# EAGLE design StepperBreakout (EAGLE 6.5.0)
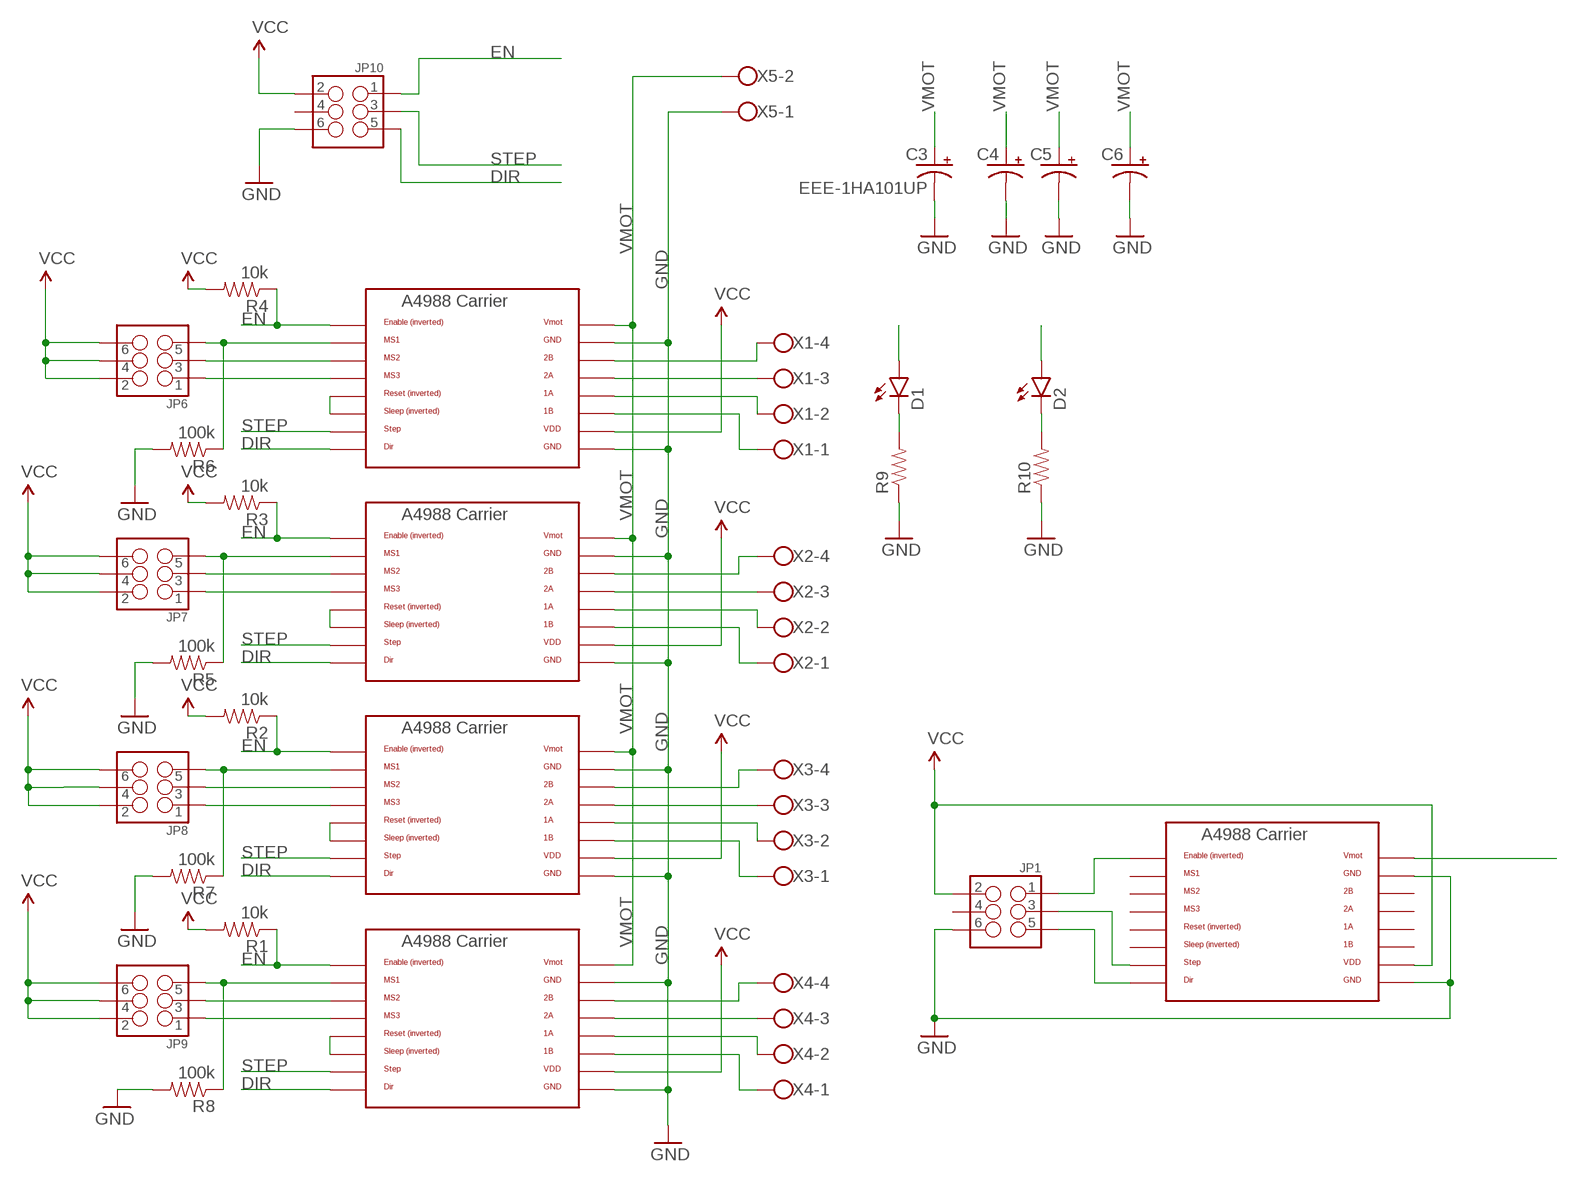
[diagram p0: schematic, sheet 1]

## Parts
C3  EEE-1HA101UP  CAP_POLE  [PANASONIC_E]
C4  CAP_POLE  [PANASONIC_E]
C5  CAP_POLE  [PANASONIC_E]
C6  CAP_POLE  [PANASONIC_E]
D1  LED0603  [LED-0603]
D2  LED0603  [LED-0603]
JP1  M03X2SHROUD  [2X3-SHROUDED]
JP6  M03X2NO_SILK  [2X3-NS]
JP7  M03X2NO_SILK  [2X3-NS]
JP8  M03X2NO_SILK  [2X3-NS]
JP9  M03X2NO_SILK  [2X3-NS]
JP10  M03X2SHROUD  [2X3-SHROUDED]
R1  10k  RESISTOR0805-RES  [0805]
R2  10k  RESISTOR0805-RES  [0805]
R3  10k  RESISTOR0805-RES  [0805]
R4  10k  RESISTOR0805-RES  [0805]
R5  100k  RESISTOR0805-RES  [0805]
R6  100k  RESISTOR0805-RES  [0805]
R7  100k  RESISTOR0805-RES  [0805]
R8  100k  RESISTOR0805-RES  [0805]
R9  RESISTOR0805-RES  [0805]
R10  RESISTOR0805-RES  [0805]
U$1  POLOLU_A4983CARRIER  [A4988BREAKOUT]
U$2  POLOLU_A4983CARRIER  [A4988BREAKOUT]
U$3  POLOLU_A4983CARRIER  [A4988BREAKOUT]
U$4  POLOLU_A4983CARRIER  [A4988BREAKOUT]
U$7  A4988BREAKOUT  [A4988BREAKOUT]
X1  W237-4  [W237-4]
X2  W237-4  [W237-4]
X3  W237-4  [W237-4]
X4  W237-4  [W237-4]
X5  W237-102  [W237-102]

## Nets
DIR: JP10.5 U$1.DIR U$2.DIR U$3.DIR U$4.DIR
EN: JP10.1 R1.1 R2.1 R3.1 R4.1 U$1.EN U$2.EN U$3.EN U$4.EN
GND: C3.- C4.- C5.- C6.- JP1.6 JP10.6 R5.2 R6.2 R7.2 R8.2 R9.1 R10.1 U$1.GND U$1.GND@0(GND) U$2.GND U$2.GND@0(GND) U$3.GND U$3.GND@0(GND) U$4.GND U$4.GND@0(GND) U$7.GND U$7.GND@0(GND) X5.1
LOPOWER: JP1.2 U$7.VDD ; supply symbol labelled VCC
N$1: U$3.1B X2.1
N$2: U$3.1A X2.2
N$3: U$3.2A X2.3
N$4: U$3.2B X2.4
N$5: U$1.2B X3.4
N$6: U$1.2A X3.3
N$7: U$1.1A X3.2
N$8: U$1.1B X3.1
N$9: U$2.2B X4.4
N$10: U$2.2A X4.3
N$11: U$2.1A X4.2
N$12: U$2.1B X4.1
N$13: U$4.2B X1.4
N$14: U$4.2A X1.3
N$15: U$4.1A X1.2
N$16: U$4.1B X1.1
N$17: JP6.5 R6.1 U$4.MS1
N$18: JP6.3 U$4.MS2
N$19: JP6.1 U$4.MS3
N$20: JP7.5 R5.1 U$3.MS1
N$21: JP7.3 U$3.MS2
N$22: JP7.1 U$3.MS3
N$23: JP8.5 R7.1 U$1.MS1
N$24: JP8.3 U$1.MS2
N$25: JP8.1 U$1.MS3
N$26: JP9.5 R8.1 U$2.MS1
N$27: JP9.3 U$2.MS2
N$28: JP9.1 U$2.MS3
N$29: JP1.1 U$7.EN
N$30: D1.C R9.2
N$31: D2.C R10.2
N$32: JP1.5 U$7.DIR
N$33: U$2.RST U$2.SLP(SLEEP)
N$34: U$1.RST U$1.SLP(SLEEP)
N$35: U$3.RST U$3.SLP(SLEEP)
N$36: U$4.RST U$4.SLP(SLEEP)
N$37: JP1.3 U$7.STEP
N$38: U$7.VMOT
STEP: JP10.3 U$1.STEP U$2.STEP U$3.STEP U$4.STEP
VCC: D2.A JP6.2 JP6.4 JP6.6 JP7.2 JP7.4 JP7.6 JP8.2 JP8.4 JP8.6 JP9.2 JP9.4 JP9.6 JP10.2 R1.2 R2.2 R3.2 R4.2 U$1.VDD U$2.VDD U$3.VDD U$4.VDD
VMOT: C3.+ C4.+ C5.+ C6.+ D1.A U$1.VMOT U$2.VMOT U$3.VMOT U$4.VMOT X5.2
Unconnected: JP1.4 JP10.4 U$7.1A U$7.1B U$7.2A U$7.2B U$7.MS1 U$7.MS2 U$7.MS3 U$7.RST U$7.SLP(SLEEP)

## Library data of the parts
C3-C6 = SparkFun-Capacitors:CAP_POL: Capacitor Polarized These are standard SMD and PTH capacitors. Normally 10uF, 47uF, and 100uF in electrolytic and tantalum varieties. Always verify the external diameter of the through hole cap, it varies with capacity, voltage, and manufacturer. The EIA devices should be standard.
D1 D2 = SparkFun-LED:LED: LEDs Standard schematic elements and footprints for 5mm, 3mm, 1206, and 0603 sized LEDs. 5mm - Spark Fun Electronics SKU : COM-00529 (and others)
JP1 JP10 = SparkFun-Connectors:M03X2: 2x3 .1" header. Shrouded, with keying- CONN-10681 SMT- CONN-11415 Pogo pins- HW-11044; PROD_ID: CONN-10681
JP6-JP9 = SparkFun-Connectors:M03X2: 2x3 .1" header. Shrouded, with keying- CONN-10681 SMT- CONN-11415 Pogo pins- HW-11044
R1-R8 = SparkFun-Passives:RESISTOR: Resistor Basic schematic elements and footprints for 0603, 1206, and PTH resistors.
R9 R10 = SparkFun-Resistors:RESISTOR: Resistor Basic schematic elements and footprints for 0603, 1206, and PTH resistors.
U$1-U$4 = RepRapjr:POLOLU_A4983CARRIER
U$7 = RepRapjr:A4988BREAKOUT
X1-X4 = con-wago-500:W237-4: WAGO SCREW CLAMP; OC_FARNELL: unknown; OC_NEWARK: unknown
X5 = con-wago-500:W237-102: WAGO SCREW CLAMP; MPN: 237-102; OC_FARNELL: unknown; OC_NEWARK: 70K9898

## Board
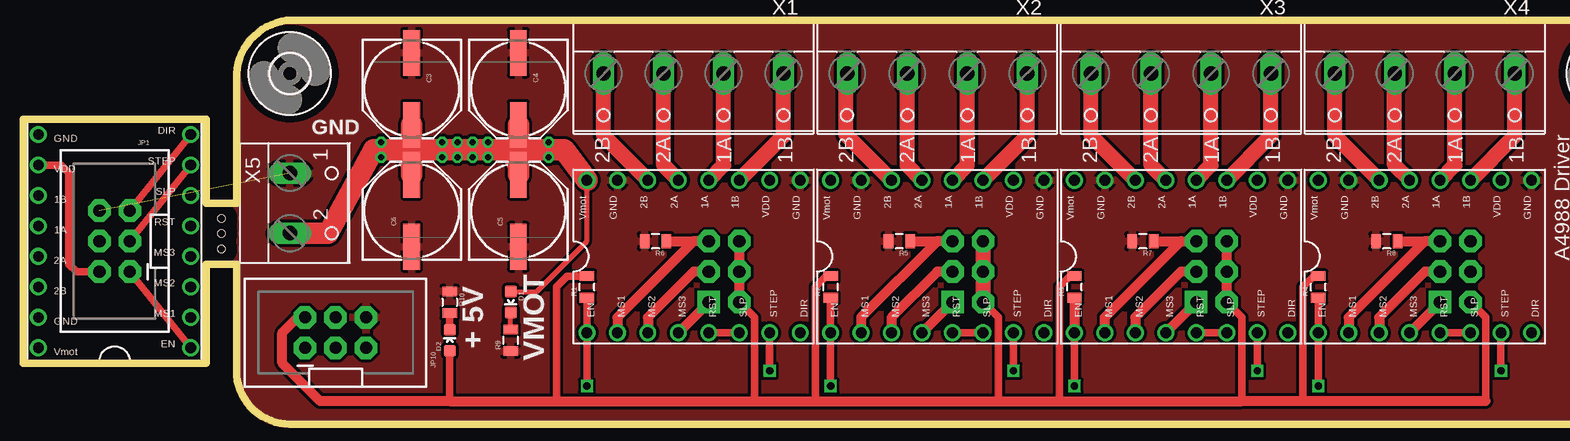
[diagram p1: board, top side]
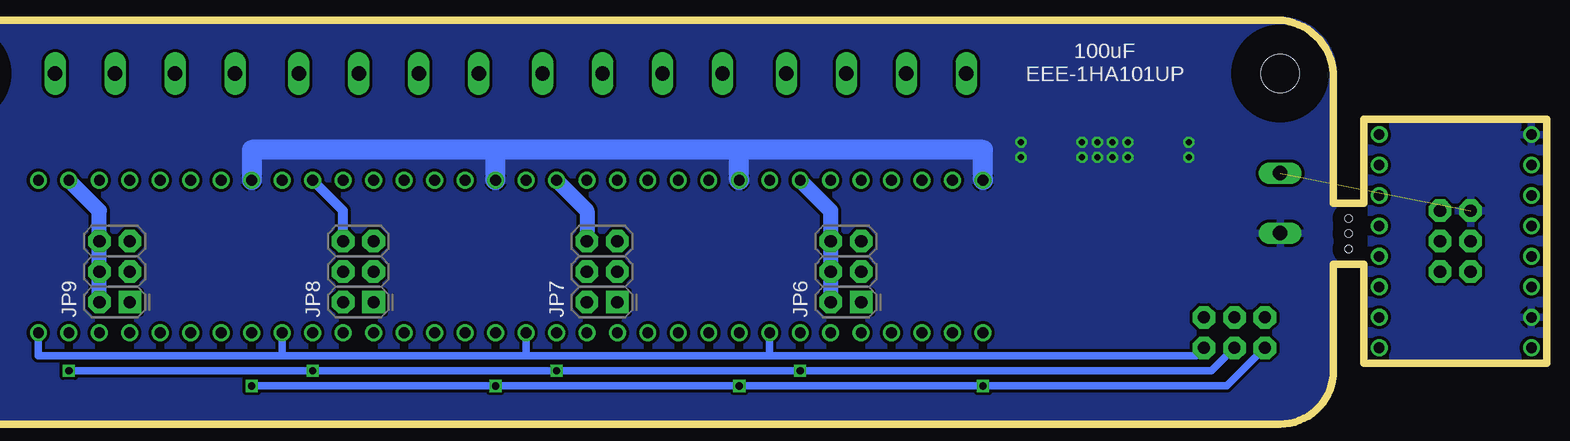
[diagram p2: board, bottom side, seen from below]

No outline drawn. Coordinates in mm, seen from the top.
Copper layers (1*16): Top 0.035mm / dielectric 1.5mm / Bottom 0.035mm
Design rules "default *": minimum track width 10mil, minimum drill 24mil, track to track 10mil, track to pad 10mil, pad to pad 10mil, via to via 10mil, smd to smd 10mil, copper to edge 40mil, drill to drill 8mil, minimum pad ring 10mil, minimum via ring 8mil, stop-mask expansion 4mil, vias tented up to drill 0mil, thermal gap 10mil
Holes 0.6 mm at 17.78,15.88 17.78,17.14 17.78,14.61
Milling: 16 lines

### Footprints (pad centres in the part's own frame; a part is rotated, then mirrored left to right if it is on the bottom)
PANASONIC_E = smd 3.8 x 1.4: + 3,0; - -3,0
LED-0603 = smd 1 x 1: A 0,-0.877; C 0,0.877
2X3-SHROUDED = drill 1.016 pad 1.88 octagon: 1 -1.27,2.54; 2 1.27,2.54; 3 -1.27,0; 4 1.27,0; 5 -1.27,-2.54; 6 1.27,-2.54
2X3-NS = drill 1.016 pad 1.88 square: 1 -2.54,-1.27 | drill 1.016 pad 1.88 octagon: 2 -2.54,1.27; 3 0,-1.27; 4 0,1.27; 5 2.54,-1.27; 6 2.54,1.27
0805 = smd 0.8 x 1.2: 1 -0.9,0; 2 0.9,0
A4988BREAKOUT = drill 0.9: 1A 8.89,1.27; 1B 11.43,1.27; 2A 6.35,1.27; 2B 3.81,1.27; DIR 16.51,-11.43; EN -1.27,-11.43; GND 16.51,1.27; GND@0 1.27,1.27; MS1 1.27,-11.43; MS2 3.81,-11.43; MS3 6.35,-11.43; RST 8.89,-11.43; SLP 11.43,-11.43; STEP 13.97,-11.43; VDD 13.97,1.27; VMOT -1.27,1.27
3,2 = hole 3.2: 0,0
W237-4 = drill 1.194 long: 1 -7.5,-1.27; 2 -2.5,-1.27; 3 2.5,-1.27; 4 7.5,-1.27
W237-102 = drill 1.194 long: 1 -2.5,-1.27; 2 2.5,-1.27

### Placement (x,y rotation side)
C3  33.66,27.94 270 top
C4  42.55,27.94 270 top
C5  42.55,17.78 90 top
C6  33.66,17.78 90 top
D1  41.91,10.16 180 top
D2  36.83,6.99 0 top
JP1  8.89,15.24 180 top
JP6  59.69,12.7 90 bottom
JP7  80.01,12.7 90 bottom
JP8  100.33,12.7 90 bottom
JP9  120.65,12.7 90 bottom
JP10  27.3,7.62 90 top
R1  48.26,11.43 90 top
R2  68.58,11.43 90 top
R3  88.9,11.43 90 top
R4  109.22,11.43 90 top
R5  74.3,15.24 180 top
R6  53.98,15.24 180 top
R7  94.61,15.24 180 top
R8  114.94,15.24 180 top
R9  41.91,6.99 90 top
R10  36.83,10.16 270 top
U$1  90.17,19.05 0 top
U$2  110.49,19.05 0 top
U$3  69.85,19.05 0 top
U$4  49.53,19.05 0 top
U$5  [3,2]  23.5,29.21 0 top
U$6  [OSHW-LOGO-M]  133.35,5.08 90 top
U$7  3.81,7.62 90 top
U$9  [3,2]  133.35,29.21 0 top
X1  57.15,27.94 180 top
X2  77.47,27.94 180 top
X3  97.79,27.94 180 top
X4  118.11,27.94 180 top
X5  24.77,18.41 270 top

### Tracks (layer width: path | path; a pad name or v marks a point on that pad's centre or on a via)
DIR
  Bottom 0.61: U$4.DIR 66.04,5.71 | 86.36,5.71 66.04,5.71 | U$3.DIR 86.36,5.71 | 86.36,5.71 106.68,5.71 | 106.68,5.71 U$1.DIR | U$2.DIR 127,5.71 106.68,5.71 | 66.04,5.71 30.48,5.71 JP10.5
EN  (via drill 0.6)
  Top 0.61: R1.1 U$4.EN v48.26,3.17 | R2.1 U$3.EN v68.58,3.17 | R4.1 U$2.EN v109.22,3.17 | U$1.EN v88.9,3.17
  Top 0.813: R3.1 U$1.EN
  Bottom 0.61: v109.22,3.17 v88.9,3.17 v68.58,3.17 v48.26,3.17 27.94,3.17 JP10.1
GND  (1 unrouted)
  pour Top: 19.05,29.21 19.05,4.45 arc98 24.13,0 133.99,0 arc90 137.79,4.45 137.79,29.21 arc90 133.35,33.66 24.13,33.66 arc90
  pour Bottom: 1.91,24.77 15.88,24.77 15.88,5.71 1.91,5.71
LOPOWER
  Top 0.61: JP1.2 5.71,12.7 5.08,13.34 5.08,20.95 4.45,21.59 U$7.VDD
N$1
  Top 1.27: U$3.1B 84.97,24.01 X2.1
N$2
  Top 1.27: 78.75,20.34 79.97,21.55 X2.2
  Top 1.422: 78.75,20.34 U$3.1A
N$3
  Top 1.27: U$3.2A 74.97,21.55 X2.3
N$4
  Top 1.27: U$3.2B 69.85,24.13 69.85,29.21 X2.4
N$5
  Top 1.27: U$1.2B 90.29,24.01 X3.4
N$6
  Top 1.27: U$1.2A 95.29,21.55 X3.3
N$7
  Top 1.27: 99.08,20.34 100.29,21.55 X3.2
  Top 1.422: 99.08,20.34 U$1.1A
N$8
  Top 1.27: U$1.1B 105.29,24.01 X3.1
N$9
  Top 1.27: U$2.2B 110.61,24.01 X4.4
N$10
  Top 1.27: U$2.2A 115.57,21.59 115.57,29.21 X4.3
N$11
  Top 1.27: U$2.1A 120.61,21.55 X4.2
N$12
  Top 1.27: U$2.1B 125.61,24.01 X4.1
N$13
  Top 1.27: U$4.2B 49.65,24.01 X1.4
N$14
  Top 1.27: U$4.2A 54.65,21.55 X1.3
N$15
  Top 1.27: 58.44,20.34 59.65,21.55 X1.2
  Top 1.422: 58.44,20.34 U$4.1A
N$16
  Top 1.27: U$4.1B 64.65,24.01 X1.1
N$17
  Top 0.813: R6.1 57.15,15.24 | JP6.5 57.15,15.24 | 57.15,15.24 50.8,8.89 U$4.MS1
N$18
  Top 0.813: JP6.3 57.15,12.7 53.34,8.89 U$4.MS2
N$19
  Top 0.813: U$4.MS3 JP6.1
N$20
  Top 0.813: R5.1 77.47,15.24 | JP7.5 77.47,15.24 | 77.47,15.24 71.12,8.89 U$3.MS1
N$21
  Top 0.813: JP7.3 77.47,12.7 73.66,8.89 U$3.MS2
N$22
  Top 0.813: JP7.1 U$3.MS3
N$23
  Top 0.813: R7.1 97.79,15.24 | 97.79,15.24 JP8.5 | U$1.MS1 91.44,8.89 97.79,15.24
N$24
  Top 0.813: JP8.3 97.79,12.7 93.98,8.89 U$1.MS2
N$25
  Top 0.813: JP8.1 U$1.MS3
N$26
  Top 0.813: R8.1 118.11,15.24 | JP9.5 118.11,15.24 | 118.11,15.24 111.76,8.89 U$2.MS1
N$27
  Top 0.813: JP9.3 118.11,12.7 114.3,8.89 U$2.MS2
N$28
  Top 0.813: U$2.MS3 JP9.1
N$29
  Top 0.61: JP1.1 U$7.EN
N$30
  Top 0.406: R9.2 D1.C
N$31
  Top 0.61: D2.C R10.2
N$32
  Top 0.61: JP1.5 U$7.DIR
N$33
  Top 0.61: U$2.RST U$2.SLP
N$34
  Top 0.61: U$1.RST U$1.SLP
N$35
  Top 0.61: U$3.SLP U$3.RST
N$36
  Top 0.61: U$4.SLP U$4.RST
N$37
  Top 0.61: JP1.3 U$7.STEP
STEP  (via drill 0.6)
  Top 0.61: v83.82,4.45 U$3.STEP | U$4.STEP v63.5,4.45 | U$1.STEP v104.14,4.45 | v124.46,4.45 U$2.STEP
  Bottom 0.61: v124.46,4.45 v104.14,4.45 v83.82,4.45 v63.5,4.45 29.21,4.45 JP10.3
VCC  (via drill 0.6)
  Top 0.61: 102.87,1.91 102.87,8.89 JP8.2 | JP9.2 123.19,8.89 123.19,1.91 | JP7.2 82.55,8.89 82.55,1.91 | R3.2 88.53,12.33 87.63,11.43 87.63,1.91 | R2.2 68.21,12.33 67.31,11.43 67.31,1.91 | R4.2 108.85,12.33 107.95,11.43 107.95,1.91 | JP6.2 62.23,8.89 62.23,1.91 | R1.2 46.62,12.33 45.72,11.43 45.72,1.91 | D2.A 36.83,1.91
  Top 0.813: JP8.2 JP8.4 JP8.6 | JP7.2 JP7.4 JP7.6 | JP6.6 JP6.4 JP6.2 | 123.19,1.91 107.95,1.91 102.87,1.91 87.63,1.91 82.55,1.91 67.31,1.91 62.23,1.91 45.72,1.91 36.83,1.91 26.04,1.91 22.86,5.08 22.86,7.62 24.13,8.89 JP10.2
  Top 1.27: JP7.6 JP7.2
  Bottom 0.813: JP8.6 101.6,17.78 U$1.VDD
  Bottom 1.27: U$3.VDD 81.28,17.78 JP7.6 | JP9.2 JP9.4 JP9.6 121.92,17.78 U$2.VDD | U$4.VDD 60.96,17.78 JP6.6 JP6.4 JP6.2
  other vias: 81.28,15.24 60.96,10.16
VMOT  (via drill 0.5)
  Top 0.406: U$4.VMOT 48.26,15.24 44.06,11.04 D1.A
  Top 1.778: X5.2 26.71,15.91 30.48,22.86 33.02,22.86 | 33.66,22.86 41.91,22.86 | 41.91,22.86 42.55,22.86 | 42.55,22.86 46.35,22.86 U$4.VMOT | C4.+ 42.55,22.86 | C6.+ 33.66,21.59 33.02,22.86 | C3.+ 33.66,22.86 | 33.66,22.86 33.02,22.86 | C5.+ 42.55,21.59 41.91,22.86
  Bottom 1.676: 68.58,22.86 48.26,22.86 U$4.VMOT | 68.58,22.86 88.9,22.86 | 88.9,22.86 109.22,22.86 U$2.VMOT | U$1.VMOT 88.9,22.86 | U$3.VMOT 68.58,22.86
  other vias: 31.11,23.5 31.11,22.23 36.2,23.5 36.2,22.23 37.47,22.23 37.47,23.5 38.73,22.23 38.73,23.5 40.01,22.23 40.01,23.5 45.09,22.23 45.09,23.5
  pour Bottom: 19.05,19.05 19.05,29.21 arc-90 23.5,33.66 133.35,33.66 arc-90 137.79,29.21 137.79,3.81 arc-90 133.99,0 23.5,0 arc-90 19.05,4.45

### Text on the board
tPlace: GND | A4988 Driver / Expander | hackaday.io / /project/11900 | 2B | 2A | 1A | 1B | 2B | 2A | 1A | 1B | 2B | 2A | 1A | 1B | 2B | 2A | 1A | 1B | + 5V | VMOT
bPlace: 100uF / EEE-1HA101UP